# EAGLE design ArmazConnect - Rev B2 (EAGLE 7.5.0)
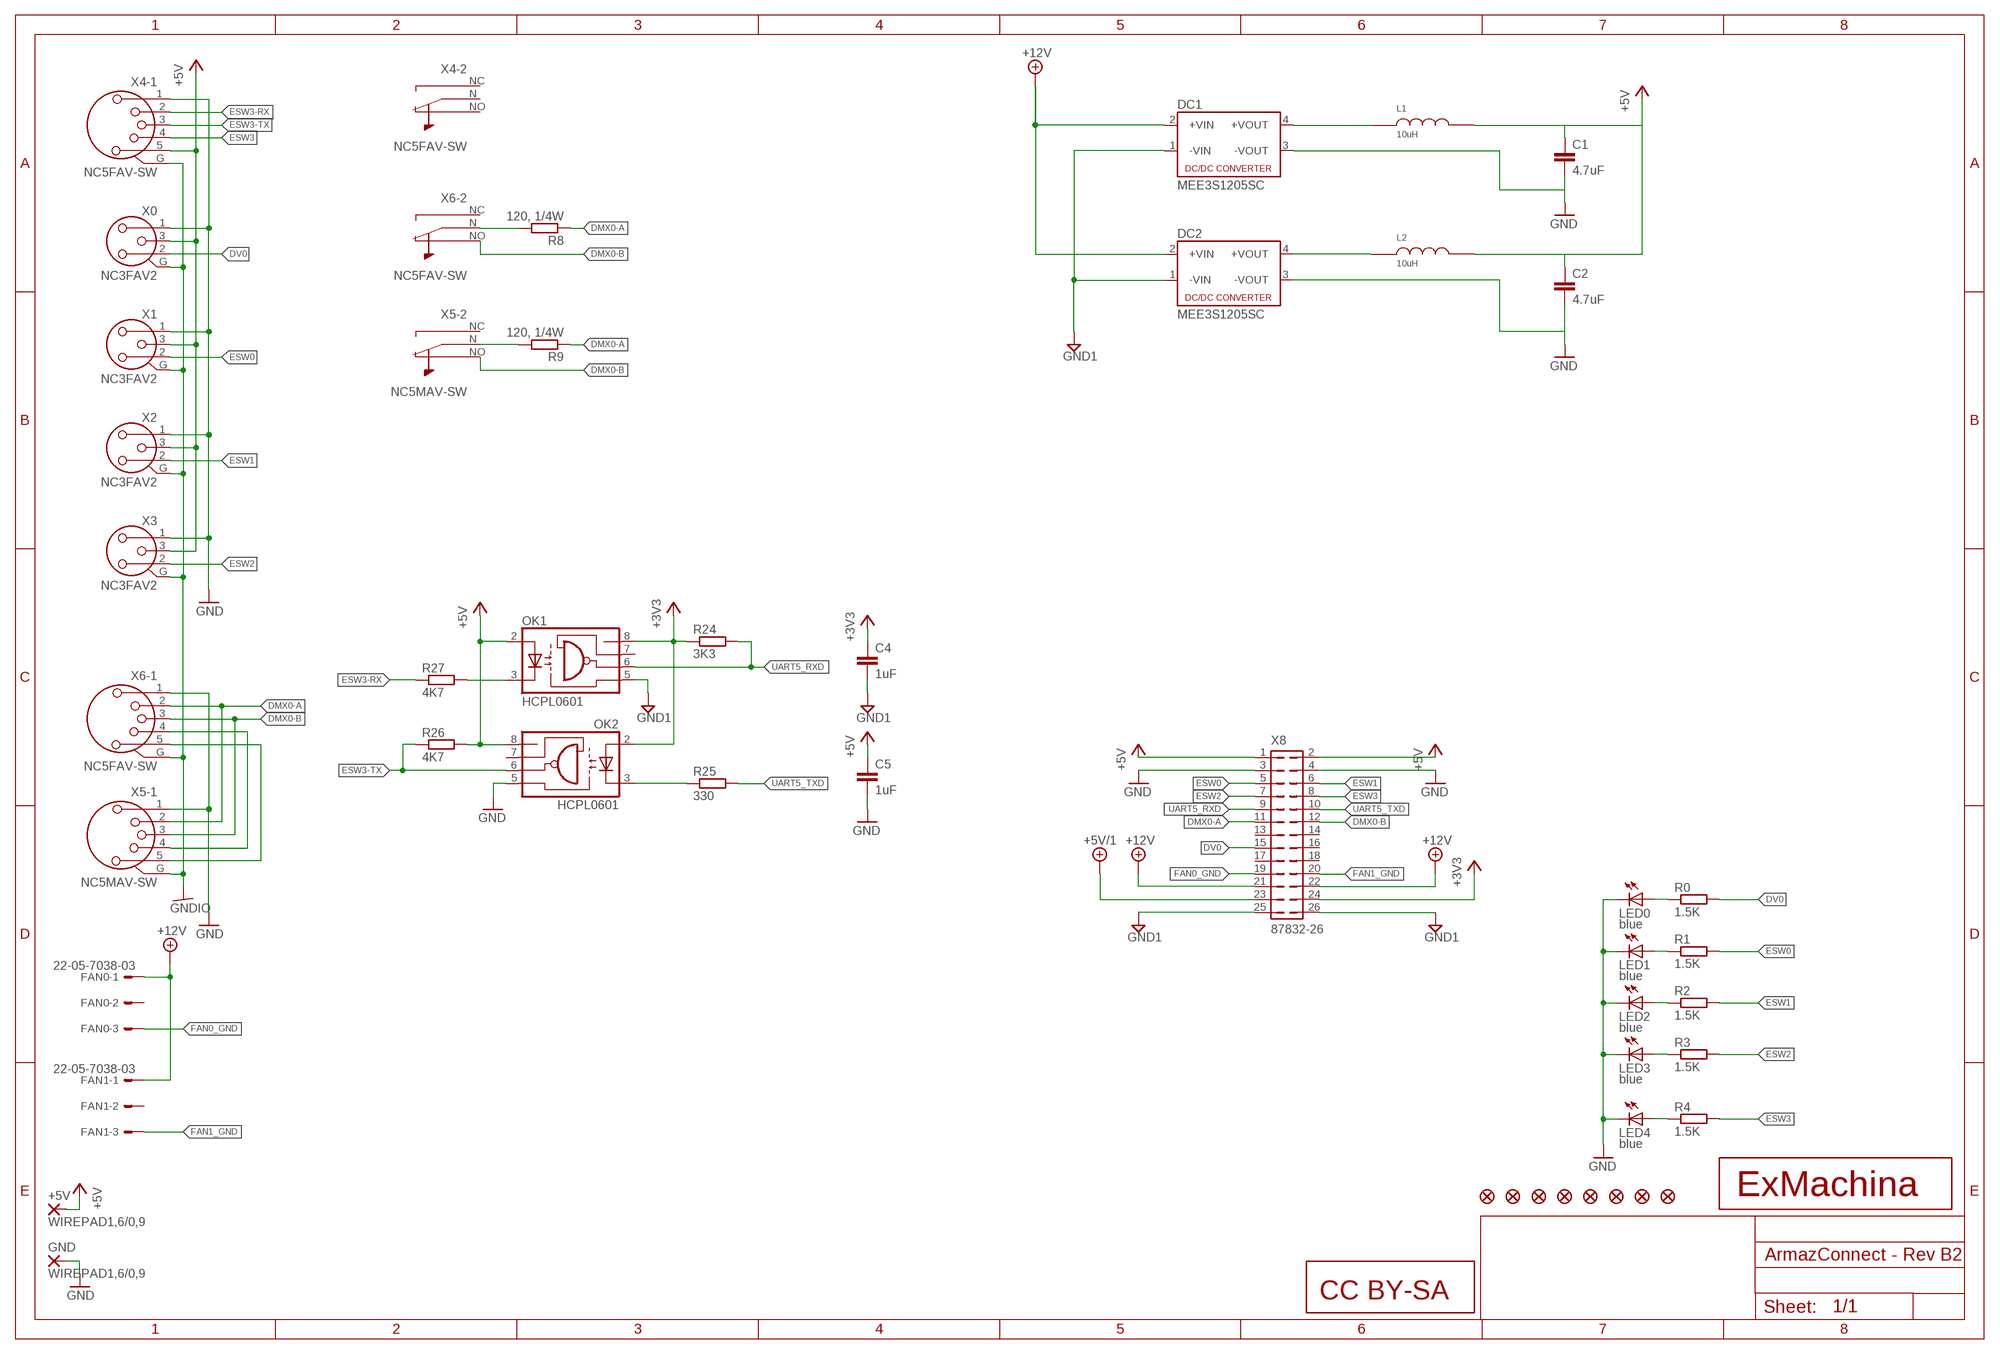
[diagram p0: schematic, sheet 1]

## Parts
+5V  WIREPAD1,6/0,9  [1,6/0,9]
C1  4.7uF  C-EUC0603  [C0603]
C2  4.7uF  C-EUC0603  [C0603]
C4  1uF  C-EUC0805  [C0805]
C5  1uF  C-EUC0805  [C0805]
DC1  MEE3S1205SC  [MEE3]
DC2  MEE3S1205SC  [MEE3]
FAN0  22-05-7038-03  [7395-03]
FAN1  22-05-7038-03  [7395-03]
FI1  FIDUCIAL1X2  [FIDUCIAL-1X2]
FI2  FIDUCIAL1X2  [FIDUCIAL-1X2]
FI3  FIDUCIAL1X2  [FIDUCIAL-1X2]
FI4  FIDUCIAL1X2  [FIDUCIAL-1X2]
FI5  FIDUCIAL1X2  [FIDUCIAL-1X2]
FI6  FIDUCIAL1X2  [FIDUCIAL-1X2]
FI7  FIDUCIAL1X2  [FIDUCIAL-1X2]
FI8  FIDUCIAL1X2  [FIDUCIAL-1X2]
GND  WIREPAD1,6/0,9  [1,6/0,9]
L1  10uH  84103C  [8200]
L2  10uH  84103C  [8200]
LED0  blue  LEDCHIP-LED0603  [CHIP-LED0603]
LED1  blue  LEDCHIP-LED0603  [CHIP-LED0603]
LED2  blue  LEDCHIP-LED0603  [CHIP-LED0603]
LED3  blue  LEDCHIP-LED0603  [CHIP-LED0603]
LED4  blue  LEDCHIP-LED0603  [CHIP-LED0603]
OK1  HCPL0601  [SOIC08]
OK2  HCPL0601  [SOIC08]
R0  1.5K  R-EU_R0603  [R0603]
R1  1.5K  R-EU_R0603  [R0603]
R2  1.5K  R-EU_R0603  [R0603]
R3  1.5K  R-EU_R0603  [R0603]
R4  1.5K  R-EU_R0603  [R0603]
R8  120, 1/4W  R-EU_R0603  [R0603]
R9  120, 1/4W  R-EU_R0603  [R0603]
R24  3K3  R-EU_R0402  [R0402]
R25  330  R-EU_R0603  [R0603]
R26  4K7  R-EU_R0603  [R0603]
R27  4K7  R-EU_R0603  [R0603]
U$1  EXMACHINA-LOGO-NAME  [EXM-LOGO-BASELINE]
U$2  CC-BY-SA  [CC-BY-SA]
X0  NC3FAV2  [NC3FAV2]
X1  NC3FAV2  [NC3FAV2]
X2  NC3FAV2  [NC3FAV2]
X3  NC3FAV2  [NC3FAV2]
X4  NC5FAV-SW  [NC5FAV-SW]
X5  NC5MAV-SW  [NC5MAV-SW]
X6  NC5FAV-SW  [NC5FAV-SW]
X8  87832-26  [87832-26]

## Nets
+3V3: C4.1 OK1.8(VCC) OK2.2(A) R24.1 X8.24
+5V [supply]: +5V.1(P) C1.1 C2.1 C5.1 L1.2 L2.2 OK1.2(A) OK2.8(VCC) R26.2 X0.3 X1.3 X2.3 X3.3 X4.5 X8.1 X8.2
+5V/1 [supply]: X8.23
+12V [supply]: DC1.2(+VIN) DC2.2(+VIN) FAN0.1 FAN1.1 X8.21 X8.22
DMX0-A: R8.1 R9.1 X5.2 X6.2 X8.11
DMX0-B: X5.3 X5.NO(-2:NO) X6.3 X6.NO(-2:NO) X8.12
DV0: R0.2 X0.2 X8.15
ESW0: R1.2 X1.2 X8.5
ESW1: R2.2 X2.2 X8.6
ESW2: R3.2 X3.2 X8.7
ESW3: R4.2 X4.4 X8.8
ESW3-RX: R27.1 X4.2
ESW3-TX: OK2.6(VO) R26.1 X4.3
FAN0_GND [supply]: FAN0.3 X8.19
FAN1_GND [supply]: FAN1.3 X8.20
GND [supply]: C1.2 C2.2 C5.2 DC1.3(-VOUT) DC2.3(-VOUT) GND.1(P) LED0.C LED1.C LED2.C LED3.C LED4.C OK2.5(GND) X0.1 X1.1 X2.1 X3.1 X4.1 X5.1 X6.1 X8.3 X8.4
GND1 [supply]: C4.2 DC1.1(-VIN) DC2.1(-VIN) OK1.5(GND) X8.25 X8.26
GNDIO: X0.G X1.G X2.G X3.G X4.G(-1:G) X5.G(-1:G) X6.G(-1:G)
N$1: LED1.A R1.1
N$2: LED2.A R2.1
N$3: LED3.A R3.1
N$4: LED4.A R4.1
N$5: DC1.4(+VOUT) L1.1
N$7: DC2.4(+VOUT) L2.1
N$8: R8.2 X6.N(-2:N)
N$15: R9.2 X5.N(-2:N)
N$16: LED0.A R0.1
N$17: OK2.3(C) R25.1
N$20: OK1.3(C) R27.2
N$27: X5.4 X6.4
N$28: X5.5 X6.5
UART5_RXD: OK1.6(VO) R24.2 X8.9
UART5_TXD: R25.2 X8.10
Unconnected: FAN0.2 FAN1.2 OK1.7(VE) OK2.7(VE) X4.N(-2:N) X4.NC(-2:NC) X4.NO(-2:NO) X5.NC(-2:NC) X6.NC(-2:NC) X8.13 X8.14 X8.16 X8.17 X8.18

## Library data of the parts
+5V GND = wirepad:WIREPAD: Wire PAD connect wire on PCB; OC_FARNELL: unknown
C1 C2 = rcl:C-EU: CAPACITOR, European symbol; MF: MULTICOMP; MPN: MC0603X475K6R3CT; OC_FARNELL: 2320811
C4 C5 = rcl:C-EU: CAPACITOR, European symbol; MF: MULTICOMP; MPN: MC0805F105Z500CT; OC_FARNELL: 1759432
DC1 DC2 = dc-dc-converter:MEE3; MF: MURATA POWER SOLUTIONS; MPN: MEE3S1205SC; OC_FARNELL: 2083742
FAN0 FAN1 = con-molex:22-?-03: CONNECTOR wire to board 2.54 mm (.1 inch) pitch header; MF: MOLEX; MPN: 22-05-7038; OC_FARNELL: 9731610; OC_NEWARK: unknown
FI1-FI8 = SparkFun:FIDUCIAL: Fiducial Alignment Points Various fiducial points for machine vision alignment.; OC_FARNELL: unknown
L1 L2 = murata-inductance:84103C; MF: WURTH ELEKTRONIK; MPN: 744045100; OC_FARNELL: 1800409
LED0 LED1-LED4 = led:LED: LED OSRAM: - CHIPLED LG R971, LG N971, LY N971, LG Q971, LY Q971, LO R971, LY R971 LH N974, LH R974 LS Q976, LO Q976, LY Q976 LO Q996 - Hyper CHIPLED LW Q18S LB Q993, LB Q99A, LB R99A - SideLED LS A670, LO A670, LY A670, LG A670, LP A670 LB A673, LV A673, LT A673, LW A673 LH A674 LY A675 LS A676, LA A676, LO A676, LY A676, LW A676 LS A679, LY A679, LG A679 - Hyper Micro SIDELED® LS Y876, LA Y876, LO Y876, LY Y876 LT Y87S - SmartLED LW L88C, LW L88S LB L89C, LB L89S, LG L890 LS L89K, LO L89K, LY L89K LS L896, LA L896, LO L896, LY L896 - TOPLED LS T670, LO T670, LY T670, LG T670, LP T670 LSG T670, LSP T670, LSY T670, LOP T670, LYG T670 LG T671, LOG T671, LSG T671 LB T673, LV T673, LT T673, LW T673 LH T674 LS T676, LA T676, LO T676, LY T676, LB T676, LH T676, LSB T676, LW T676 LB T67C, LV T67C, LT T67C, LS T67K, LO T67K, LY T67K, LW E67C LS E67B, LA E67B, LO E67B, LY E67B, LB E67C, LV E67C, LT E67C LW T67C LS T679, LY T679, LG T679 LS T770, LO T770, LY T770, LG T770, LP T770 LB T773, LV T773, LT T773, LW T773 LH T774 LS E675, LA E675, LY E675, LS T675 LS T776, LA T776, LO T776, LY T776, LB T776 LHGB T686 LT T68C, LB T68C - Hyper Mini TOPLED® LB M676 - Mini TOPLED Santana® LG M470 LS M47K, LO M47K, LY M47K Source: http://www.osram.convergy.de LUXEON: - LUMILED® LXK2-PW12-R00, LXK2-PW12-S00, LXK2-PW14-U00, LXK2-PW14-V00 LXK2-PM12-R00, LXK2-PM12-S00, LXK2-PM14-U00 LXK2-PE12-Q00, LXK2-PE12-R00, LXK2-PE12-S00, LXK2-PE14-T00, LXK2-PE14-U00 LXK2-PB12-K00, LXK2-PB12-L00, LXK2-PB12-M00, LXK2-PB14-N00, LXK2-PB14-P00, LXK2-PB14-Q00 LXK2-PR12-L00, LXK2-PR12-M00, LXK2-PR14-Q00, LXK2-PR14-R00 LXK2-PD12-Q00, LXK2-PD12-R00, LXK2-PD12-S00 LXK2-PH12-R00, LXK2-PH12-S00 LXK2-PL12-P00, LXK2-PL12-Q00, LXK2-PL12-R00 Source: www.luxeon.com KINGBRIGHT: KA-3528ASYC Source: www.kingbright.com; MF: MULTICOMP; MPN: OVS-0603; OC_FARNELL: 1716770
OK1 OK2 = optocoupler:HCPL0601: HEWLETT PACKARD OPTO COUPLER; MF: AVAGO TECHNOLOGIES; MPN: HCPL-0601-000E; OC_FARNELL: 9995102; OC_NEWARK: 88H7776
R0 R1-R4 = rcl:R-EU_: RESISTOR, European symbol; MF: MULTICOMP; MPN: MCMR06X1501FTL; OC_FARNELL: 2073391
R8 R9 = rcl:R-EU_: RESISTOR, European symbol; MF: MULTICOMP; MPN: MCMR06X1200FTL; OC_FARNELL: 2073369
R24 = rcl:R-EU_: RESISTOR, European symbol; MF: MULTICOMP; MPN: MCMR04X3301FTL; OC_FARNELL: 2072928
R25 = rcl:R-EU_: RESISTOR, European symbol; MF: MULTICOMP; MPN: MCMR06X3300FTL; OC_FARNELL: 2073472
R26 R27 = rcl:R-EU_: RESISTOR, European symbol; MF: MULTICOMP; MPN: MCMR06X4701FTL; OC_FARNELL: 2073509
U$1 = exmachina:EXMACHINA-LOGO; OC_FARNELL: unknown
U$2 = cc-by-sa:CC-BY-SA; OC_FARNELL: unknown
X0 X1-X3 = con-neutrik_ag:NC3: Neutrik Audio Connector XLR SERIES Stereo 1/4" jack Source: www.neutrik.com/; MF: NEUTRIK; MPN: NC3FAAV2; OC_FARNELL: 1310038; OC_NEWARK: 83F7211
X4 X6 = con-neutrik_ag:NC5?-SW: Neutrik Audio Connector XLR SERIES Stereo 1/4" jack Source: www.neutrik.com/; MF: NEUTRIK; MPN: NC5FAV-SW; OC_FARNELL: 1310093
X5 = con-neutrik_ag:NC5?-SW: Neutrik Audio Connector XLR SERIES Stereo 1/4" jack Source: www.neutrik.com/; MF: NEUTRIK; MPN: NC5MAV-SW; OC_FARNELL: 1310098
X8 = con-molex:87832-26: Milli-Grid Header 2.00mm (.079") Pitch; MF: MOLEX; MPN: 87832-2620; OC_FARNELL: 2313712; OC_NEWARK: unknown

## Net classes
0 default: width 0.152 mm, drill 0.25 mm, clearance 0.205 mm
1 supply: width 0.406 mm, drill 0.35 mm, clearance 0.205 mm to class 0, clearance 0.205 mm
2 supply2: width 0.203 mm, drill 0.25 mm, clearance 0.205 mm to class 0, clearance 0.205 mm to class 1, clearance 0.205 mm

## Board
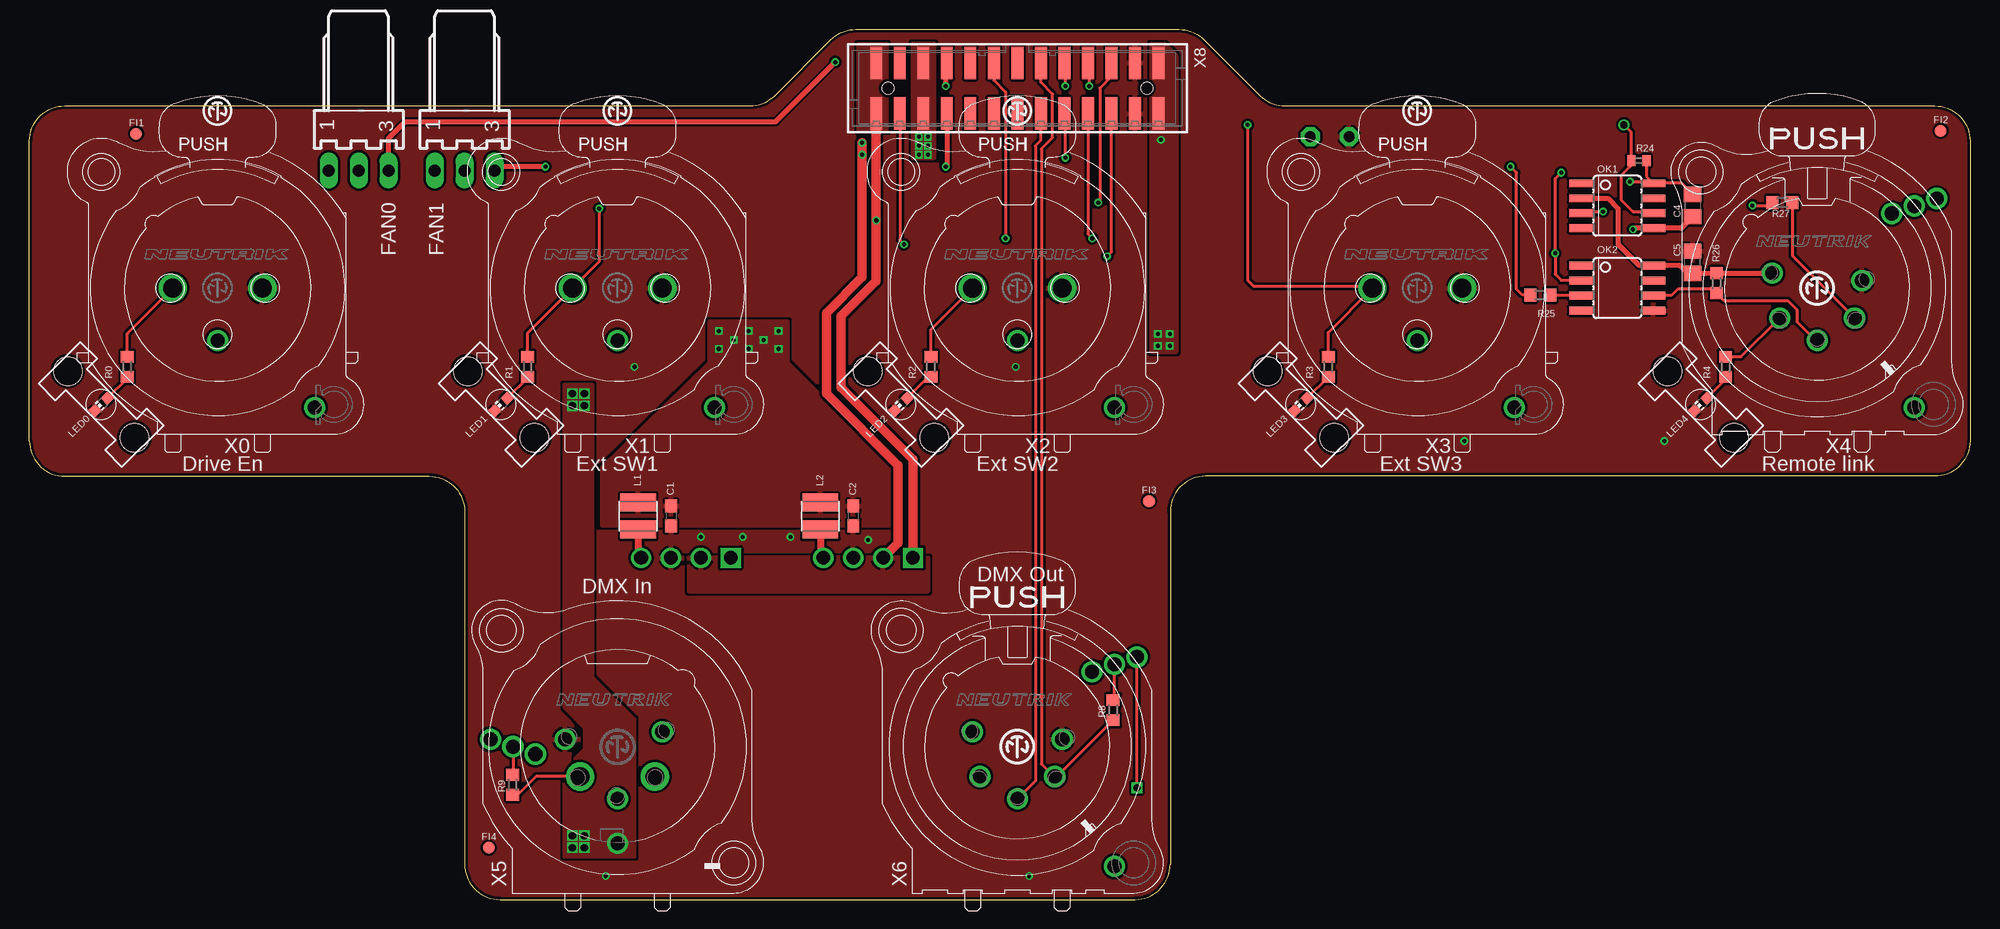
[diagram p1: board, top side]
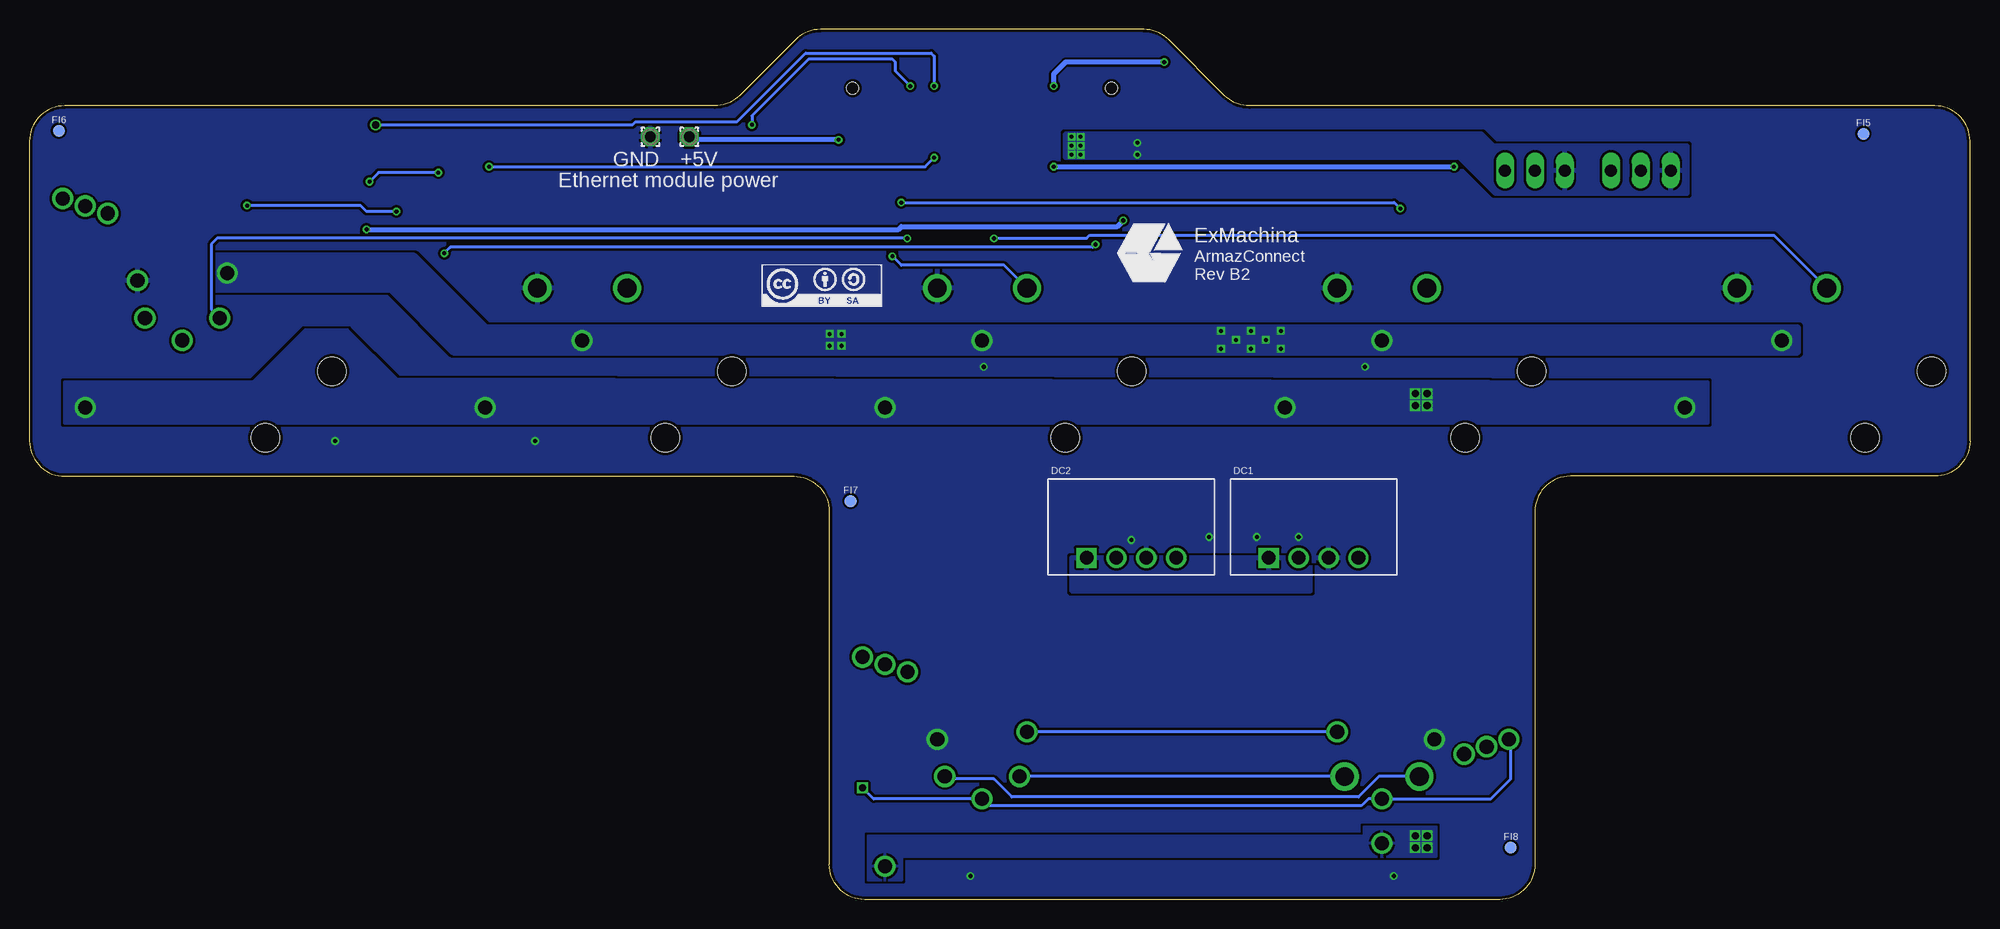
[diagram p2: board, bottom side, seen from below]

Size 165 x 74 mm. Coordinates in mm from the lower left corner, seen from the top.
Outline: 0,39 0,64.5 arc-90 3,67.5 61.26,67.5 arc45 63.38,68.38 68.12,73.12 arc-45 70.24,74 97.76,74 arc-45 99.88,73.12 104.62,68.38 arc45 106.74,67.5 162,67.5 arc-90 165,64.5 165,39 arc-90 162,36 100,36 arc90 97,33 97,3 arc-90 94,0 40,0 arc-90 37,3 37,33 arc90 34,36 3,36 arc-90 0,39
Copper layers (1*16): Top 0.018mm / dielectric 1.55mm / Bottom 0.018mm
Design rules "eC_2Layer_PClass5_BaseCopperO18 *": minimum track width 0.175mm, minimum drill 0.35mm, track to track 0.175mm, track to pad 0.175mm, pad to pad 0.175mm, via to via 0.175mm, smd to smd 0mil, copper to edge 0.25mm, drill to drill 0.35mm, minimum pad ring 0.2mm, minimum via ring 0.15mm, stop-mask expansion 0mil, vias tented up to drill 0.45mm, thermal gap 0.2mm

### Footprints (pad centres in the part's own frame; a part is rotated, then mirrored left to right if it is on the bottom)
1,6/0,9 = drill 0.914 pad 1.6 octagon: 1 0,0
C0603 = smd 1.1 x 1: 1 -0.85,0; 2 0.85,0
C0805 = smd 1.3 x 1.5: 1 -0.95,0; 2 0.95,0
MEE3 = drill 1.15 square: 1 -3.81,0 | drill 1.15: 2 -1.27,0; 3 1.27,0; 4 3.81,0
7395-03 = drill 1.016 long: 1 2.54,0; 2 0,0; 3 -2.54,0
FIDUCIAL-1X2 = smd 1 x 1: 1 0,0
8200 = smd 3.05 x 1.52: 1 0,1.145; 2 0,-1.145
CHIP-LED0603 = smd 0.8 x 0.8: A 0,-0.75; C 0,0.75
SOIC08 = smd 0.66 x 2.032: 1 -1.905,-3.073; 2 -0.635,-3.073; 3 0.635,-3.073; 4 1.905,-3.073; 5 1.905,3.073; 6 0.635,3.073; 7 -0.635,3.073; 8 -1.905,3.073
R0603 = smd 1 x 1.1: 1 -0.85,0; 2 0.85,0
R0402 = smd 0.7 x 0.9: 1 -0.65,0; 2 0.65,0
1275.100 = hole 2.4: 4,0; -4,0
NC3FAV2 = drill 1.6: 1 3.81,0; 2 -3.81,0 | drill 1.2: 3 0,-4.45; G 8.25,-10.16
NC5FAV-SW = drill 1.2: 1 3.81,0.635; 2 3.175,-2.54; 3 0,-4.445; 4 -3.175,-2.54; 5 -3.81,1.27; G 8.255,-10.16; N 8.255,6.985; NC 6.35,6.35; NO 10.16,7.62
NC5MAV-SW = drill 1.2: 1 -4.445,0.635; 3 0,-4.445; 5 3.81,1.27; G 0,-8.225; N -8.89,0; NC -6.985,-0.635; NO -10.795,0.635 | drill 1.6: 2 -3.175,-2.54; 4 3.175,-2.54
87832-26 = smd 1 x 2.75: 1 -12,-2.15; 2 -12,2.15; 3 -10,-2.15; 4 -10,2.15; 5 -8,-2.15; 6 -8,2.15; 7 -6,-2.15; 8 -6,2.15; 9 -4,-2.15; 10 -4,2.15; 11 -2,-2.15; 12 -2,2.15; 13 0,-2.15; 14 0,2.15; 15 2,-2.15; 16 2,2.15; 17 4,-2.15; 18 4,2.15; 19 6,-2.15; 20 6,2.15; 21 8,-2.15; 22 8,2.15; 23 10,-2.15; 24 10,2.15; 25 12,-2.15; 26 12,2.15 | hole 1: -11,0; 11,0

### Placement (x,y rotation side)
+5V  108.9,64.87 180 bottom
C1  54.55,32.61 270 top
C2  70.04,32.61 270 top
C4  141.41,59.02 270 top
C5  141.41,54.2 90 top
DC1  55.82,29.05 0 bottom
DC2  71.31,29.05 0 bottom
FAN0  28,62 180 top
FAN1  37,62 180 top
FI1  9.08,65.12 0 top
FI2  162.5,65.37 0 top
FI3  95.19,33.88 0 top
FI4  39.05,4.41 0 top
FI5  9.08,65.12 0 bottom
FI6  162.5,65.37 0 bottom
FI7  95.19,33.88 0 bottom
FI8  39.05,4.41 0 bottom
GND  112.2,64.87 180 bottom
L1  51.75,32.61 180 top
L2  67.25,32.61 180 top
LED0  6.1,42.1 135 top
LED1  40.1,42.1 135 top
LED2  74.1,42.1 135 top
LED3  108.1,42.1 135 top
LED4  142.1,42.1 135 top
OK1  135,59 270 top
OK2  135,52 270 top
R0  8.32,45.31 90 top
R1  42.35,45.31 90 top
R2  76.64,45.31 90 top
R3  110.43,45.31 90 top
R4  144.21,45.31 90 top
R8  92.14,16.1 90 top
R9  41.08,9.75 90 top
R24  136.84,62.83 180 top
R25  128.46,51.4 180 top
R26  143.45,52.42 90 top
R27  149.03,59.28 180 top
U$1  69.79,54.96 0 bottom
U$2  97.47,52.67 0 bottom
U$31  [1275.100]  6.1,42.1 315 top
U$32  [1275.100]  40.1,42.1 315 top
U$33  [1275.100]  74.1,42.1 315 top
U$34  [1275.100]  108.1,42.1 315 top
U$35  [1275.100]  142.1,42.1 315 top
X0  16,52 0 top
X1  50,52 0 top
X2  84,52 0 top
X3  118,52 0 top
X4  152,52 0 top
X5  50,13 0 top
X6  84,13 0 top
X8  84,69 180 top

### Tracks (layer width: path | path; a pad name or v marks a point on that pad's centre or on a via)
+3V3  (via drill 0.35)
  Top 0.254: C4.1 140.48,60.91 OK1.8 | R24.1 137.49,61.49 OK1.8 | X8.24 74,56.08 v74.36,55.72 | OK2.2 131.89,52.67 130.24,52.67 129.73,53.18 v129.73,54.96 129.73,61.31 v130.24,61.82 | v136.08,61.06 137.92,61.06 OK1.8
  Bottom 0.254: v74.36,55.72 74.61,55.47 129.22,55.47 v129.73,54.96 | v130.24,61.82 135.32,61.82 v136.08,61.06
+5V  (via drill 0.35)
  Top 0.406: X4.5 R26.2 141.82,53.27 141.8,53.25 C5.1 141.03,53.25 140.37,53.91 OK2.8 138.03,53.94 136.84,53.94 135.06,55.72 135.06,58.77 134.2,59.64 OK1.2
  Bottom 0.406: v96.2,64.61 108.65,64.61 +5V.1
  other vias: 95.95,47.09 95.95,48.1 58.61,48.36 58.61,46.83 63.69,46.83 63.69,48.36 62.42,47.59 59.88,47.59 61.15,48.36 61.15,46.83 96.96,48.1 96.96,47.09
  pour Bottom (rank 5, no thermals): 149.54,51.91 134.3,51.91 128.97,46.58 14.67,46.58 14.67,48.61 126.17,48.61 132.27,54.71 149.54,54.71
  pour Top (no thermals): 95.44,72.74 96.46,72.74 97.47,71.72 97.47,46.58 95.44,46.58
  pour Top: 57.85,49.12 57.85,45.56 48.7,36.67 48.7,31.85 73.6,31.85 73.6,36.42 64.45,45.56 64.45,49.12
+12V  (via drill 0.35)
  Top 0.813: DC2.2 73.85,30.32 73.85,36.93 67.75,43.02 67.75,49.88 70.8,52.93 v70.8,63.34 v70.8,64.36
  other vias: 75.63,63.34 76.39,63.34 76.39,64.87 75.63,64.87 76.39,64.1 75.63,64.1
  pour Bottom: 24.07,64.1 24.07,60.04 40.32,60.04 43.37,63.09 76.9,63.09 76.9,65.12 41.59,65.12 40.58,64.1
  pour Top (no thermals): 76.9,72.74 75.12,72.74 75.12,63.09 76.9,63.09
  pour Top: 56.07,29.05 56.07,26.26 76.39,26.26 76.39,29.05
DMX0-A
  Top 0.254: R9.1 41.5,8.9 43.12,10.51 46.77,10.51 X5.2 | R8.1 87.35,10.46 X6.2 87.11,10.46 86.04,11.53 86.04,63.85 87,64.81 87,68.5 86,69.5 X8.11
  Bottom 0.254: X5.2 50.28,10.46 52.01,8.73 81.47,8.73 82.99,10.26 86.97,10.26 X6.2
DMX0-B  (via drill 0.61)
  Top 0.254: v94.17,9.49 X6.NO | X6.3 85.53,10.09 85.53,64.1 86,64.57 X8.12
  Bottom 0.254: X5.NO 39.05,13.48 39.05,10.26 40.75,8.55 X5.3 51.17,8.55 51.75,7.97 83.42,7.97 X6.3 93.23,8.55 v94.17,9.49
DV0  (via drill 0.35)
  Top 0.254: R0.2 8.32,48.13 X0.2 | X8.15 82,69.67 82.99,68.68 v82.99,56.23
  Bottom 0.254: v82.99,56.23 75.12,56.23 74.87,56.48 16.67,56.48 X0.2
ESW0  (via drill 0.35)
  Top 0.254: R1.2 42.35,48.16 X1.2 48.45,54.26 v48.45,58.77 | X8.5 92,70 91,69 91,59.41 v90.87,59.28
  Bottom 0.254: v90.87,59.28 48.96,59.28 v48.45,58.77
ESW1  (via drill 0.35)
  Top 0.254: R2.2 76.64,48.45 X2.2 | v91.63,54.71 92,55.08 X8.6
  Bottom 0.254: X2.2 82.13,53.94 90.87,53.94 v91.63,54.71
ESW2  (via drill 0.35)
  Top 0.254: R3.2 110.43,48.24 X3.2 114.02,52.17 104.08,52.17 103.57,52.67 v103.57,65.88 | X8.7 90.11,71.04 v90.11,69.18
  Bottom 0.254: v90.11,69.18 91.38,70.45 91.38,71.22 91.63,71.47 98.74,71.47 103.57,66.64 v103.57,65.88
ESW3  (via drill 0.35)
  Top 0.254: R4.2 145.52,46.16 X4.4 | X8.8 90,56.59 v90.36,56.23
  Bottom 0.254: v90.36,56.23 149.03,56.23 149.54,55.72 149.54,50.18 X4.4
ESW3-RX
  Top 0.254: R27.1 149.88,54.75 X4.2
ESW3-TX
  Top 0.254: X4.3 151.87,47.55 150.3,49.12 150.3,50.13 149.54,50.9 144.12,50.9 R26.1 143.1,51.91 140.14,51.91 139.6,51.37 OK2.6
FAN0_GND  (via drill 0.35)
  Top 0.406: FAN0.3 30.54,64.74 31.94,66.14 63.44,66.14 v68.52,71.22 | v77.91,69.18 77.91,71.06 X8.19
  Bottom 0.406: v68.52,71.22 76.9,71.22 77.91,70.2 v77.91,69.18
FAN1_GND  (via drill 0.35)
  Top 0.406: X8.20 78,62.41 v77.91,62.33 | v43.88,62.33 39.87,62.33 FAN1.3
  Bottom 0.406: v77.91,62.33 v43.88,62.33
GND  (via drill 0.35)
  other vias: 51.45,45.31 83.86,45.31 49,2 85,2 122,39 139,39 57.09,30.83 64.71,30.83 60.64,30.83 71.31,30.58
  pour Bottom (rank 6): 0,-10 168,-10 168,98 0,98
  pour Top (rank 6): 0,-10 168,-10 168,98 0,98
  pour Bottom (rank 5, no thermals): 44.13,15.08 44.13,12.54 47.18,12.54 47.18,15.08
  pour Bottom (rank 5, no thermals): 86.3,12.54 89.34,12.54 89.34,15.59 86.3,15.59
GND1  (via drill 0.35)
  Top 0.406: C4.2 140.44,57.09 OK1.5 136.44,57.09 v136.33,56.99
  Top 0.813: X8.26 v72,57.75 72,52.6 69.02,49.63 69.02,43.53 75.12,37.43 DC2.1
  Bottom 0.406: v136.33,56.99 91.12,56.99 90.87,57.25 72.51,57.25 v72,57.75
  pour Top (no thermals): 72.83,72.74 72.83,65.37 70.55,65.37 70.55,72.74
  pour Bottom: 56.07,26.26 56.07,29.05 76.39,29.05 76.39,26.26
GNDIO  (via drill 0.6)
  other vias: 47.18,42.01 46.16,42.01 46.16,43.02 47.18,43.02 46.16,4.41 46.16,5.43 47.18,5.43 47.18,4.41
  pour Bottom (rank 2, no thermals): 22.29,44.04 22.29,40.48 162,40.48 162,44.04 145.98,44.04 141.54,48.48 137.97,48.48 133.77,44.29
  pour Top (no thermals): 51.5,3.65 51.5,15.34 47.94,18.89 47.94,43.78 45.4,43.78 45.4,16.35 47.18,14.57 47.18,12.8 45.4,11.02 45.4,3.65
  pour Bottom: 45.4,3.65 90.87,3.65 90.87,1.62 93.66,1.62 93.66,5.43 51.5,5.43 51.5,6.19 45.4,6.19
N$1
  Top 0.254: R1.1 42.35,44.35 LED1.A
N$2
  Top 0.254: R2.1 76.46,44.46 LED2.A
N$3
  Top 0.254: R3.1 110.43,44.43 LED3.A
N$4
  Top 0.254: R4.1 144.21,44.21 LED4.A
N$5
  Top 0.61: L1.1 51.75,29.31 DC1.4
N$7
  Top 0.61: L2.1 67.25,29.31 DC2.4
N$8
  Top 0.254: R8.2 92.25,17.07 X6.N
N$15
  Top 0.254: X5.N 41.11,10.62 R9.2
N$16
  Top 0.254: R0.1 8.32,44.32 LED0.A
N$17
  Top 0.254: R25.1 131.89,51.4 OK2.3
N$20  (via drill 0.35)
  Top 0.254: OK1.3 132.08,58.52 v133.79,58.52 | v146.49,59.02 147.93,59.02 R27.2
  Bottom 0.254: v133.79,58.52 136.33,58.52 136.84,59.02 v146.49,59.02
N$27
  Bottom 0.254: X5.4 X6.4
N$28
  Bottom 0.254: X5.5 X6.5
UART5_RXD  (via drill 0.35, 0.61)
  Top 0.254: OK1.6 137.92,58.52 136.33,58.52 135.32,59.53 135.32,61.56 136.08,62.33 136.08,62.72 R24.2 136.19,65.26 v135.57,65.88 | v88.07,69.18 88.07,71.08 X8.9
  Bottom 0.254: v135.57,65.88 113.73,65.88 113.47,66.14 104.84,66.14 99,71.98 88.33,71.98 88.07,71.72 v88.07,69.18
UART5_TXD  (via drill 0.35)
  Top 0.254: R25.2 126.94,51.4 126.43,51.91 126.43,61.82 v125.92,62.33 | v88.07,63.09 88.07,66.78 X8.10
  Bottom 0.254: v125.92,62.33 88.84,62.33 v88.07,63.09

### Text on the board
tNames: Drive En | Ext SW1 | Ext SW2 | Ext SW3 | Remote link | DMX Out | DMX In
bNames: Ethernet module power | ArmazConnect / Rev B2
Measures: ESW2 | DRV EN | ESW0 | ESW1 | ESW3 | DMX0-IN | DMX0-OUT | ETH0-0